# EAGLE design RelayDriverShield8 (EAGLE 9.4.2)
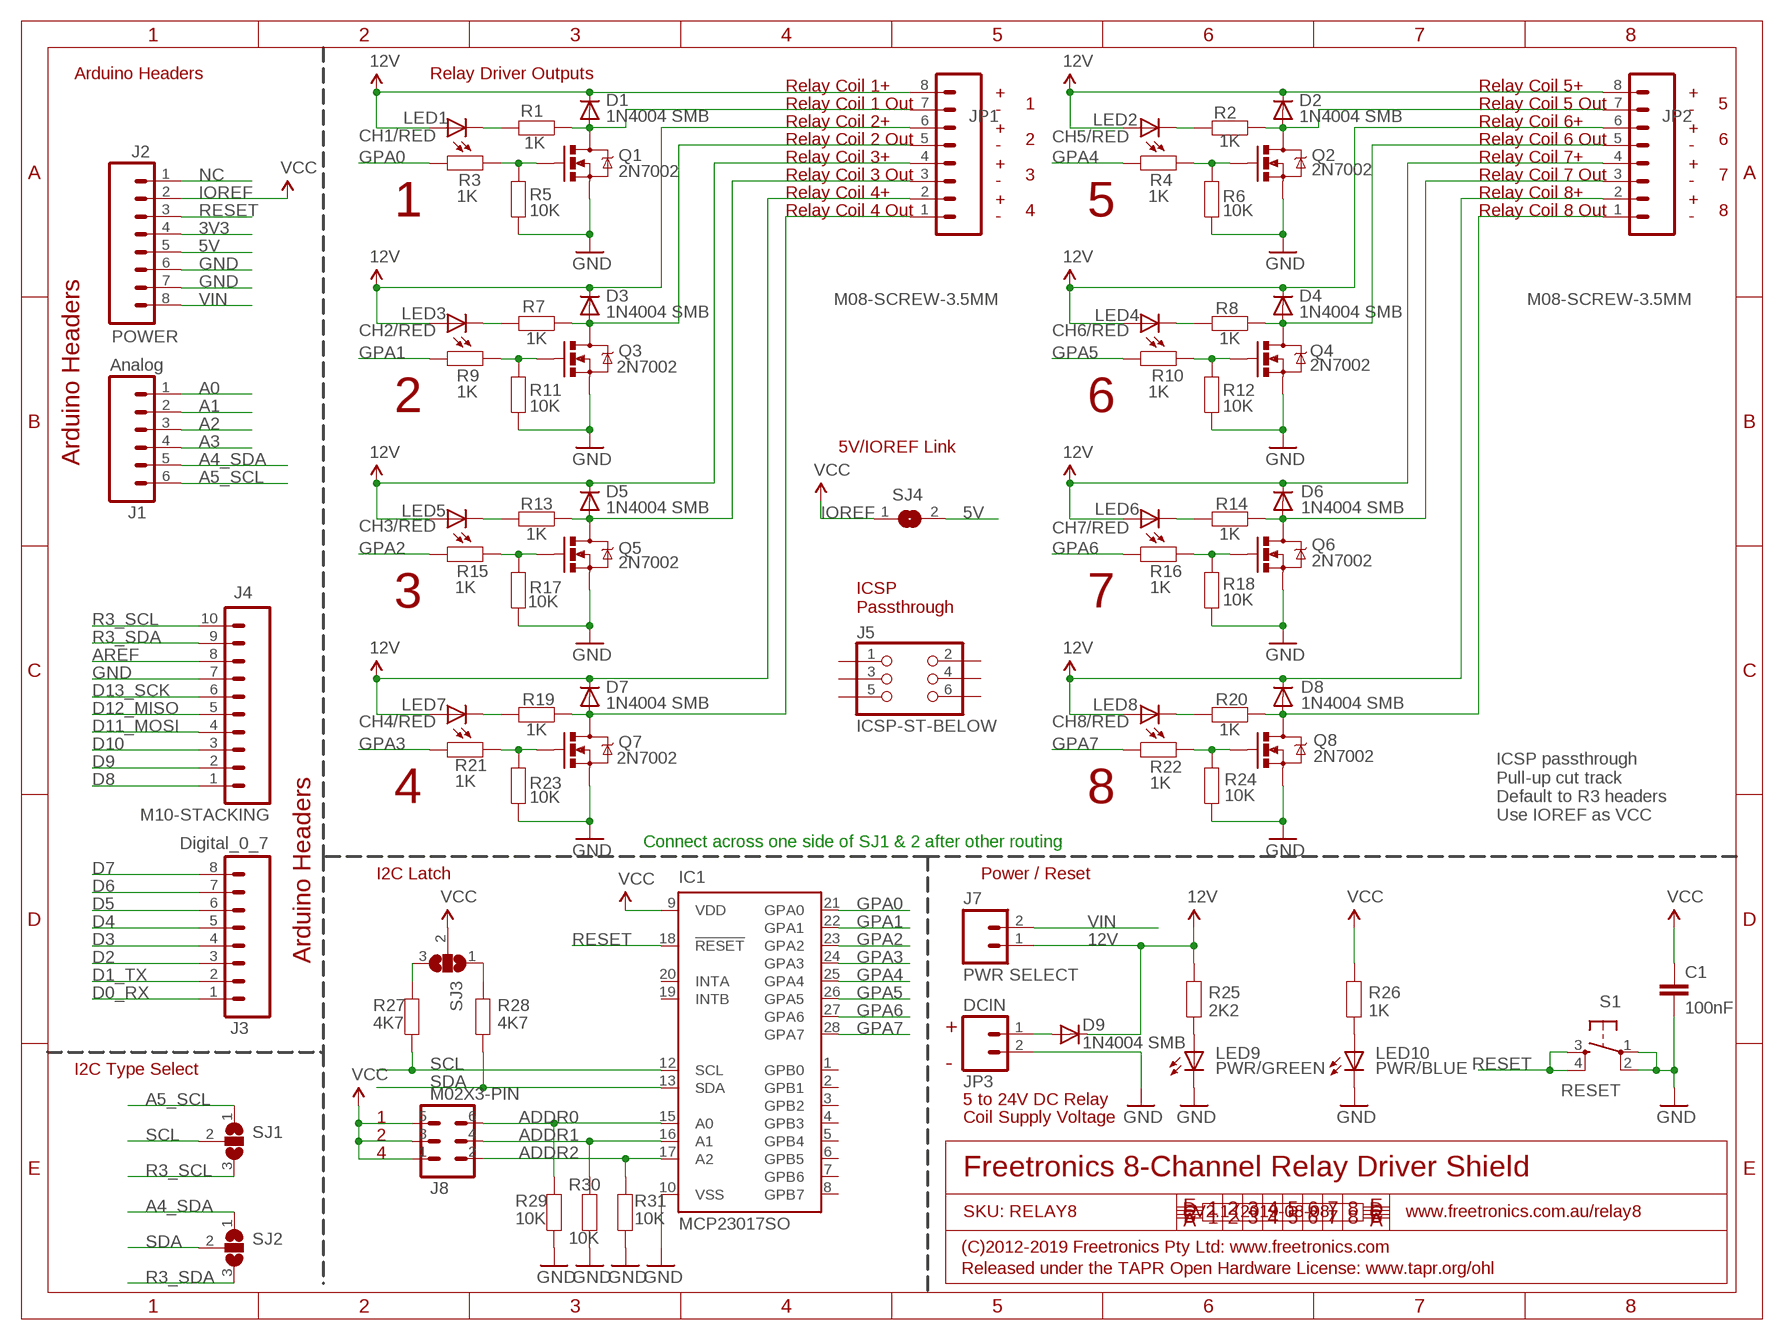
[diagram p0: schematic, sheet 1]

## Parts
C1  100nF  CAP0603  [C0603]
D1  1N4004 SMB  DIODESMA  [SMA-DIODE]
D2  1N4004 SMB  DIODESMA  [SMA-DIODE]
D3  1N4004 SMB  DIODESMA  [SMA-DIODE]
D4  1N4004 SMB  DIODESMA  [SMA-DIODE]
D5  1N4004 SMB  DIODESMA  [SMA-DIODE]
D6  1N4004 SMB  DIODESMA  [SMA-DIODE]
D7  1N4004 SMB  DIODESMA  [SMA-DIODE]
D8  1N4004 SMB  DIODESMA  [SMA-DIODE]
D9  1N4004 SMB  DIODESMA  [SMA-DIODE]
IC1  MCP23017SO  [SO28W]
J1  Analog  M06-STACKING  [1X06-ST]
J2  POWER  M08-STACKING  [1X08-ST]
J3  Digital_0_7  M08-STACKING  [1X08-ST]
J4  M10-STACKING  [1X10-ST]
J5  ICSP-ST-BELOW  [2X03-ICSP-ST-BELOW]
J7  PWR SELECT  M02-PIN  [1X02-P]
J8  M02X3-PIN  [2X03-P]
JP1  M08-SCREW-3.5MM  [SCREWTERMINAL_3.5MM_8]
JP2  M08-SCREW-3.5MM  [SCREWTERMINAL_3.5MM_8]
JP3  DCIN  M02-SCREW-3.5MM  [SCREWTERMINAL-3.5MM-2]
LED1  CH1/RED  LED0603  [LED-0603]
LED2  CH5/RED  LED0603  [LED-0603]
LED3  CH2/RED  LED0603  [LED-0603]
LED4  CH6/RED  LED0603  [LED-0603]
LED5  CH3/RED  LED0603  [LED-0603]
LED6  CH7/RED  LED0603  [LED-0603]
LED7  CH4/RED  LED0603  [LED-0603]
LED8  CH8/RED  LED0603  [LED-0603]
LED9  PWR/GREEN  LED0603  [LED-0603]
LED10  PWR/BLUE  LED0603  [LED-0603]
Q1  2N7002  MOSFET-NCHANNEL-233  [SOT23-3]
Q2  2N7002  MOSFET-NCHANNEL-233  [SOT23-3]
Q3  2N7002  MOSFET-NCHANNEL-233  [SOT23-3]
Q4  2N7002  MOSFET-NCHANNEL-233  [SOT23-3]
Q5  2N7002  MOSFET-NCHANNEL-233  [SOT23-3]
Q6  2N7002  MOSFET-NCHANNEL-233  [SOT23-3]
Q7  2N7002  MOSFET-NCHANNEL-233  [SOT23-3]
Q8  2N7002  MOSFET-NCHANNEL-233  [SOT23-3]
R1  1K  RESISTOR0603  [R0603]
R2  1K  RESISTOR0603  [R0603]
R3  1K  RESISTOR0603  [R0603]
R4  1K  RESISTOR0603  [R0603]
R5  10K  RESISTOR0603  [R0603]
R6  10K  RESISTOR0603  [R0603]
R7  1K  RESISTOR0603  [R0603]
R8  1K  RESISTOR0603  [R0603]
R9  1K  RESISTOR0603  [R0603]
R10  1K  RESISTOR0603  [R0603]
R11  10K  RESISTOR0603  [R0603]
R12  10K  RESISTOR0603  [R0603]
R13  1K  RESISTOR0603  [R0603]
R14  1K  RESISTOR0603  [R0603]
R15  1K  RESISTOR0603  [R0603]
R16  1K  RESISTOR0603  [R0603]
R17  10K  RESISTOR0603  [R0603]
R18  10K  RESISTOR0603  [R0603]
R19  1K  RESISTOR0603  [R0603]
R20  1K  RESISTOR0603  [R0603]
R21  1K  RESISTOR0603  [R0603]
R22  1K  RESISTOR0603  [R0603]
R23  10K  RESISTOR0603  [R0603]
R24  10K  RESISTOR0603  [R0603]
R25  2K2  RESISTOR0603  [R0603]
R26  1K  RESISTOR0603  [R0603]
R27  4K7  RESISTOR0603  [R0603]
R28  4K7  RESISTOR0603  [R0603]
R29  10K  RESISTOR0603  [R0603]
R30  10K  RESISTOR0603  [R0603]
R31  10K  RESISTOR0603  [R0603]
S1  RESET  TAC_SWITCH-SMT-6  [TACTILE_SMT-6MM]
SJ1  SJ2W  [SJ_2]
SJ2  SJ2W  [SJ_2]
SJ3  SJ2W  [SJ_2]
SJ4  SJN  [SJ]

## Nets
3V3: J2.4
5V: J2.5 SJ4.2
12V: D1.C D2.C D3.C D4.C D5.C D6.C D7.C D8.C D9.C J7.1 JP1.2 JP1.4 JP1.6 JP1.8 JP2.2 JP2.4 JP2.6 JP2.8 LED1.A LED2.A LED3.A LED4.A LED5.A LED6.A LED7.A LED8.A R25.2
A0: J1.1
A1: J1.2
A2: J1.3
A3: J1.4
A4_SDA: J1.5 SJ2.1
A5_SCL: J1.6 SJ1.1
ADDR0: IC1.15(A0) J8.6 R29.2
ADDR1: IC1.16(A1) J8.4 R30.2
ADDR2: IC1.17(A2) J8.2 R31.2
AREF: J4.8
D0_RX: J3.1
D1_TX: J3.2
D2: J3.3
D3: J3.4
D4: J3.5
D5: J3.6
D6: J3.7
D7: J3.8
D8: J4.1
D9: J4.2
D10: J4.3
D11_MOSI: J4.4
D12_MISO: J4.5
D13_SCK: J4.6
GND: C1.2 IC1.10(VSS) J2.6 J2.7 J4.7 JP3.2 LED9.C LED10.C Q1.2(S) Q2.2(S) Q3.2(S) Q4.2(S) Q5.2(S) Q6.2(S) Q7.2(S) Q8.2(S) R5.1 R6.1 R11.1 R12.1 R17.1 R18.1 R23.1 R24.1 R29.1 R30.1 R31.1 S1.1 S1.2
GPA0: IC1.21(GPA0) R3.2
GPA1: IC1.22(GPA1) R9.2
GPA2: IC1.23(GPA2) R15.2
GPA3: IC1.24(GPA3) R21.2
GPA4: IC1.25(GPA4) R4.2
GPA5: IC1.26(GPA5) R10.2
GPA6: IC1.27(GPA6) R16.2
GPA7: IC1.28(GPA7) R22.2
IOREF: C1.1 IC1.9(VDD) J2.2 J8.1 J8.3 J8.5 R26.2 SJ3.2 SJ4.1 ; supply symbol labelled VCC
N$1: Q1.1(G) R3.1 R5.2
N$3: D3.A JP1.5 Q3.3(D) R7.2
N$4: LED9.A R25.1
N$5: D1.A JP1.7 Q1.3(D) R1.2
N$8: Q3.1(G) R9.1 R11.2
N$9: D5.A JP1.3 Q5.3(D) R13.2
N$10: Q5.1(G) R15.1 R17.2
N$11: D7.A JP1.1 Q7.3(D) R19.2
N$12: Q7.1(G) R21.1 R23.2
N$13: D2.A JP2.7 Q2.3(D) R2.2
N$14: Q2.1(G) R4.1 R6.2
N$15: D4.A JP2.5 Q4.3(D) R8.2
N$16: Q4.1(G) R10.1 R12.2
N$17: D6.A JP2.3 Q6.3(D) R14.2
N$18: Q6.1(G) R16.1 R18.2
N$19: D8.A JP2.1 Q8.3(D) R20.2
N$20: Q8.1(G) R22.1 R24.2
N$21: LED3.C R7.1
N$22: LED7.C R19.1
N$23: LED5.C R13.1
N$24: LED1.C R1.1
N$25: LED2.C R2.1
N$26: LED4.C R8.1
N$27: LED6.C R14.1
N$28: LED8.C R20.1
N$41: D9.A JP3.1
N$42: R27.2 SJ3.3
N$43: R28.2 SJ3.1
N$52: LED10.A R26.1
NC: J2.1
R3_SCL: J4.10 SJ1.3
R3_SDA: J4.9 SJ2.3
RESET: IC1.18(!RESET) J2.3 S1.3 S1.4
SCL: IC1.12(SCL) R27.1 SJ1.2
SDA: IC1.13(SDA) R28.1 SJ2.2
VIN: J2.8 J7.2
Unconnected: IC1.1(GPB0) IC1.2(GPB1) IC1.3(GPB2) IC1.4(GPB3) IC1.5(GPB4) IC1.6(GPB5) IC1.7(GPB6) IC1.8(GPB7) IC1.19(INTB) IC1.20(INTA) J5.1 J5.2 J5.3 J5.4 J5.5 J5.6

## Notes on the sheet
- Arduino Headers | Relay Driver Outputs
- Relay Coil 1+ | Relay Coil 5+
- + | +
- Relay Coil 1 Out | 1 | Relay Coil 5 Out | 5
- - | -
- Relay Coil 2+ | Relay Coil 6+
- + | +
- Relay Coil 2 Out | 2 | Relay Coil 6 Out | 6
- - | -
- Relay Coil 3+ | Relay Coil 7+
- + | +
- Relay Coil 3 Out | 3 | Relay Coil 7 Out | 7
- - | -
- Relay Coil 4+ | Relay Coil 8+
- + | +
- 1 | Relay Coil 4 Out | 4 | 5 | Relay Coil 8 Out | 8
- - | -
- 2 | 6
- 5V/IOREF Link
- Arduino Headers
- 3 | 7
- ICSP
  Passthrough
- 4 | 8
- ICSP passthrough
  Pull-up cut track
  Default to R3 headers
  Use IOREF as VCC
- Connect across one side of SJ1 & 2 after other routing
- I2C Latch | Power / Reset
- Arduino Headers
- +
- -
- I2C Type Select
- 5 to 24V DC Relay
- 1 | Coil Supply Voltage
- 2
- 4
- Freetronics 8-Channel Relay Driver Shield
- SKU: RELAY8 | V2.1 (2019-08-08) | www.freetronics.com.au/relay8
- (C)2012-2019 Freetronics Pty Ltd: www.freetronics.com
- Released under the TAPR Open Hardware License: www.tapr.org/ohl

## Library data of the parts
C1 = SuperHouse-DiscreteSemi:CAP: Capacitor Standard ceramic capacitor
D1-D9 = SuperHouse-DiscreteSemi:DIODE: Diode Standard reverse protection diodes and small signal diodes. SMA package can handle up to about 1A. SOD-323 can handle about 200mA.
IC1 = SuperHouse-ICs:MCP23017: http://ww1.microchip.com/downloads/en/DeviceDoc/21952a.pdf Source: http://ww1.microchip.com/downloads/en/DeviceDoc/21952a.pdf
J1 = SuperHouse-Connectors:M06: 6-way header Standard 1x6 header, and screw terminal variations
J2 J3 JP1 JP2 = SuperHouse-Connectors:M08: 8-way header Standard 1x8 header, and screw terminal variations
J4 = SuperHouse-Connectors:M10: 10-way header Standard 1x10 header, and screw terminal variations
J5 = SuperHouse-Connectors:ICSP
J7 JP3 = SuperHouse-Connectors:M02: 2-way header Standard 1x2 header, and screw terminal variations
J8 = SuperHouse-Connectors:M02X3
LED1-LED10 = SuperHouse-LEDs:LED: LEDs Standard schematic elements and footprints for 5mm, 3mm, 1206, and 0603 sized LEDs. 5mm - Spark Fun Electronics SKU : COM-00529 (and others)
Q1-Q8 = SuperHouse-DiscreteSemi:MOSFET-NCHANNEL: N-channel MOSFET
R1-R31 = SuperHouse-DiscreteSemi:RESISTOR: Resistor Standard resistors.
S1 = SuperHouse-Switches:TAC_SWITCH: Momentary Switch Tactile switch, normally-open.
SJ1-SJ3 = freetronics-master-v1.1:SJ2W: SMD solder JUMPER
SJ4 = freetronics-jon:SJ: SMD solder JUMPER

## Board
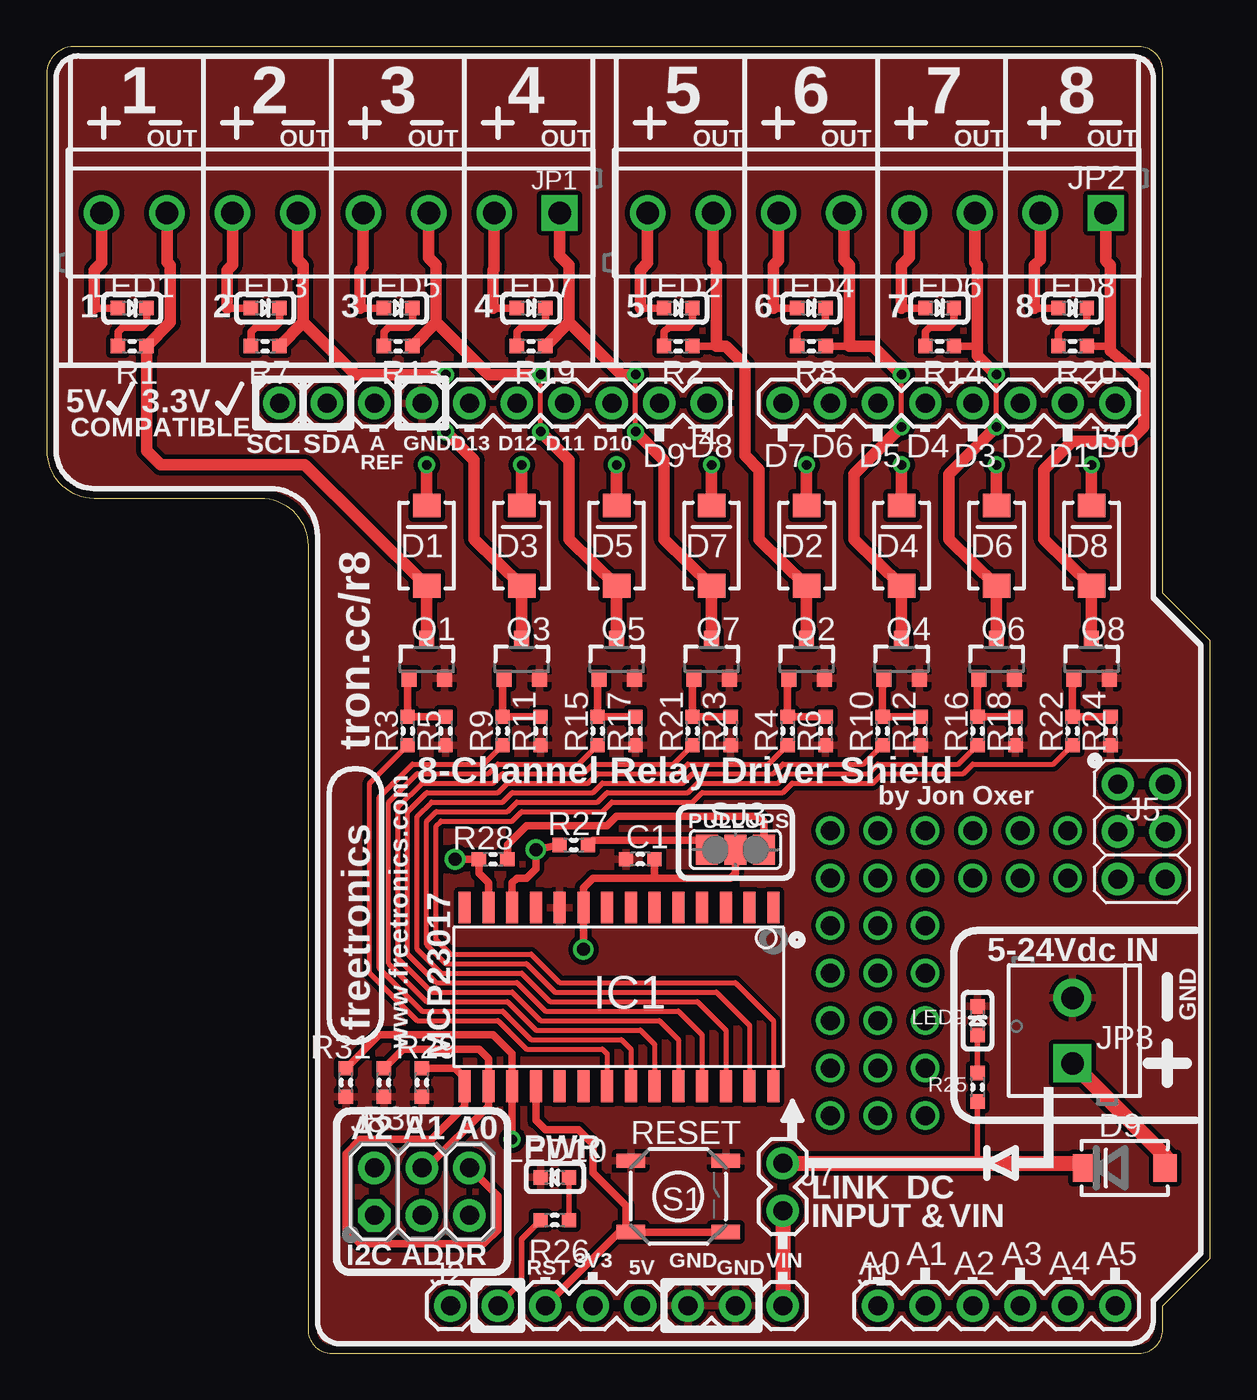
[diagram p1: board, top side]
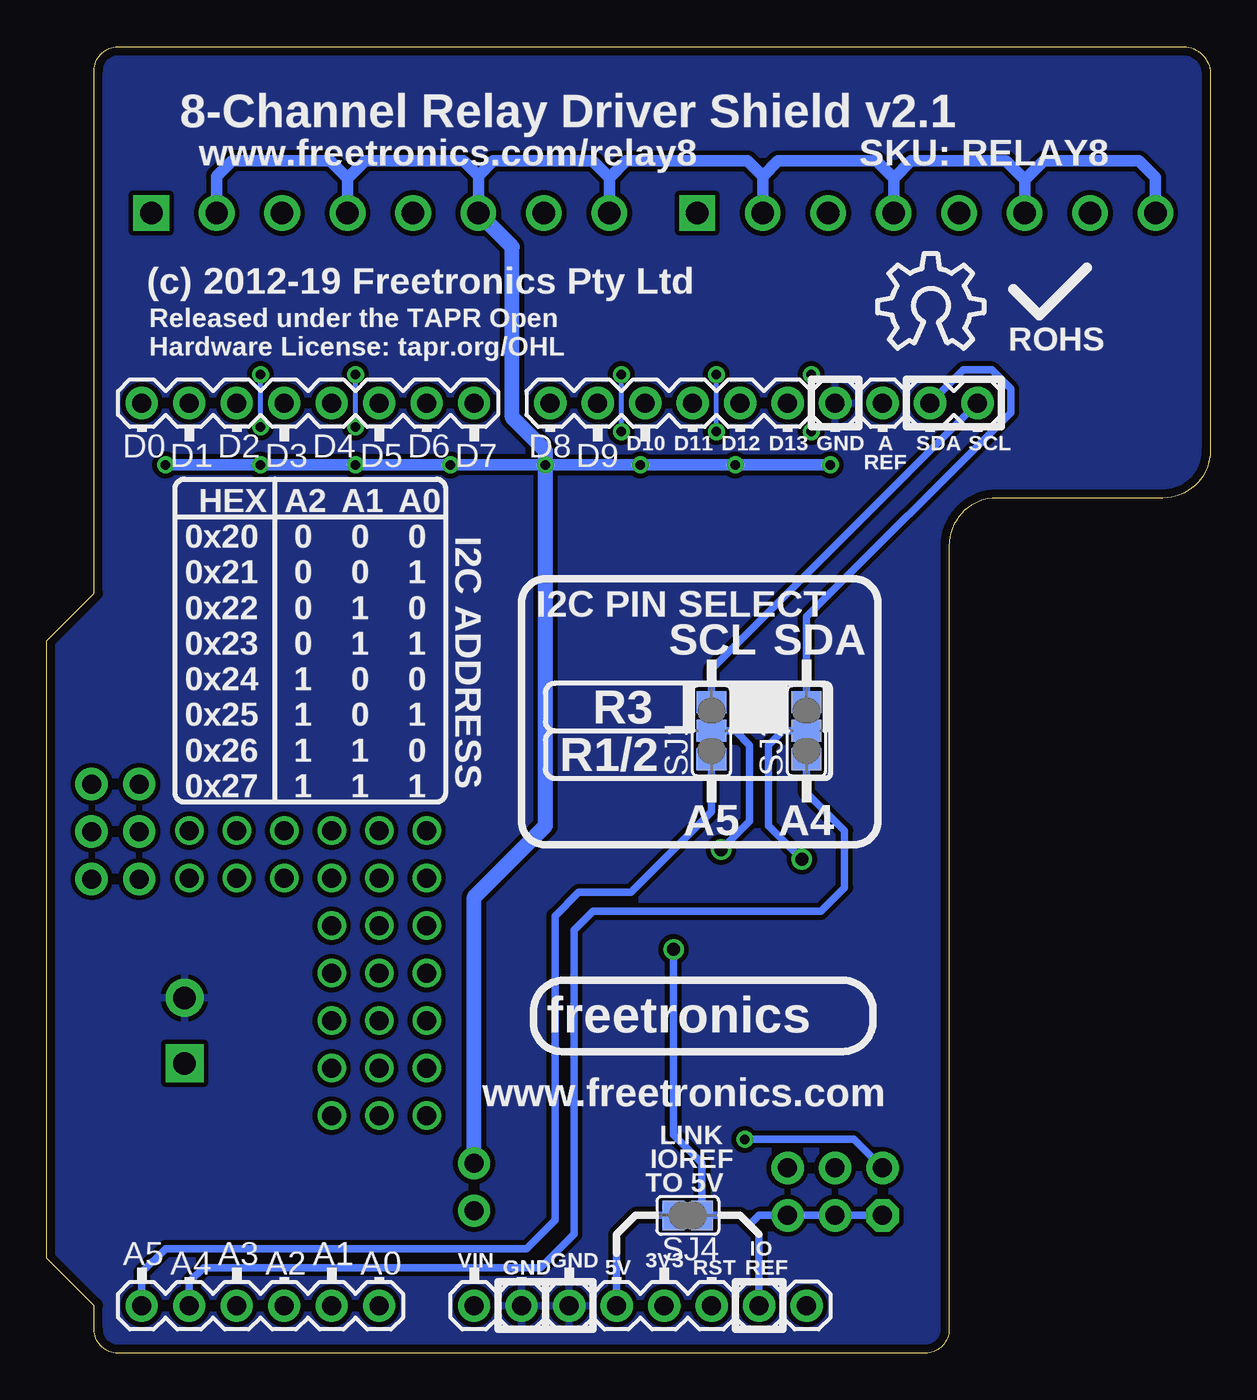
[diagram p2: board, bottom side, seen from below]

Size 62.23 x 69.85 mm. Coordinates in mm from the lower left corner, seen from the top.
Outline: 13.97,1.27 arc90 15.24,0 58.42,0 arc90 59.69,1.27 59.69,2.54 62.23,5.08 62.23,38.1 59.69,40.64 59.69,68.58 arc90 58.42,69.85 1.27,69.85 arc74 0,68.58 0,48.26 arc90 2.54,45.72 11.43,45.72 arc-90 13.97,43.18 13.97,1.27
Copper layers (1*16): Top 0.035mm / dielectric 1.5mm / Bottom 0.035mm
Design rules "default *": minimum track width 10mil, minimum drill 19mil, track to track 10mil, track to pad 12mil, pad to pad 12mil, via to via 12mil, smd to smd 8mil, copper to edge 18mil, drill to drill 8mil, minimum pad ring 14mil, minimum via ring 8mil, stop-mask expansion 4mil, vias tented up to drill 0mil, thermal gap 10mil

### Footprints (pad centres in the part's own frame; a part is rotated, then mirrored left to right if it is on the bottom)
C0603 = smd 0.762 x 0.762: 1 -0.762,0; 2 0.762,0
SMA-DIODE = smd 1.27 x 1.47: A -2.15,0; C 2.15,0
SO28W = smd 0.65 x 1.7: 1 -7.62,-4.78; 2 -6.35,-4.78; 3 -5.08,-4.78; 4 -3.81,-4.78; 5 -2.54,-4.78; 6 -1.27,-4.78; 7 0,-4.78; 8 1.27,-4.78; 9 2.54,-4.78; 10 3.81,-4.78; 11 5.08,-4.78; 12 6.35,-4.78; 13 7.62,-4.78; 14 8.89,-4.78; 15 8.89,4.78; 16 7.62,4.78; 17 6.35,4.78; 18 5.08,4.78; 19 3.81,4.78; 20 2.54,4.78; 21 1.27,4.78; 22 0,4.78; 23 -1.27,4.78; 24 -2.54,4.78; 25 -3.81,4.78; 26 -5.08,4.78; 27 -6.35,4.78; 28 -7.62,4.78
1X06-ST = drill 1.016: 1 0,0; 2 2.54,0; 3 5.08,0; 4 7.62,0; 5 10.16,0; 6 12.7,0
1X08-ST = drill 1.016: 1 0,0; 2 2.54,0; 3 5.08,0; 4 7.62,0; 5 10.16,0; 6 12.7,0; 7 15.24,0; 8 17.78,0
1X10-ST = drill 1.016: 1 0,0; 2 2.54,0; 3 5.08,0; 4 7.62,0; 5 10.16,0; 6 12.7,0; 7 15.24,0; 8 17.78,0; 9 20.32,0; 10 22.86,0
2X03-ICSP-ST-BELOW = drill 1.016: 1 -2.54,-1.27; 2 -2.54,1.27; 3 0,-1.27; 4 0,1.27; 5 2.54,-1.27; 6 2.54,1.27
1X02-P = drill 1.016: 1 0,0; 2 2.54,0
2X03-P = drill 1.016 octagon: 1 0,0 | drill 1.016: 2 0,2.54; 3 2.54,0; 4 2.54,2.54; 5 5.08,0; 6 5.08,2.54
SCREWTERMINAL_3.5MM_8 = drill 1.2 square: 1 0,0 | drill 1.2: 2 3.5,0; 3 7,0; 4 10.5,0; 5 14,0; 6 17.5,0; 7 21,0; 8 24.5,0
SCREWTERMINAL-3.5MM-2 = drill 1.2 pad 2.032 square: 1 0,0 | drill 1.2 pad 2.032: 2 3.5,0
LED-0603 = smd 0.762 x 0.762: A -0.762,0; C 0.762,0
SOT23-3 = smd 0.8 x 0.9: 1 -0.95,-1; 2 0.95,-1; 3 0,1.1
R0603 = smd 0.762 x 0.762: 1 -0.762,0; 2 0.762,0
TACTILE_SMT-6MM = smd 1.524 x 0.762: 1 -2.54,1.905; 2 2.54,1.905; 3 -2.54,-1.905; 4 2.54,-1.905
SJ_2 = smd 1.168 x 1.6: 1 -1.524,0; 2 0,0; 3 1.524,0
SJ = smd 1.168 x 1.6: 1 -0.762,0; 2 0.762,0

### Placement (x,y rotation side)
C1  31.75,26.42 180 top
D1  20.32,43.18 90 top
D2  40.64,43.18 90 top
D3  25.4,43.18 90 top
D4  45.72,43.18 90 top
D5  30.48,43.18 90 top
D6  50.8,43.18 90 top
D7  35.56,43.18 90 top
D8  55.88,43.18 90 top
D9  57.66,9.91 180 top
IC1  31.24,19.05 180 top
J1  44.45,2.54 0 top
J2  21.59,2.54 0 top
J3  57.15,50.8 180 top
J4  35.31,50.8 180 top
J5  58.56,27.89 270 top
J7  39.37,10.16 270 top
J8  17.53,7.37 0 top
JP1  27.43,60.96 180 top
JP2  56.64,60.96 180 top
JP3  54.86,15.49 90 top
LED1  4.57,55.88 0 top
LED2  33.78,55.88 0 top
LED3  11.68,55.88 0 top
LED4  40.89,55.88 0 top
LED5  18.8,55.88 0 top
LED6  47.75,55.88 0 top
LED7  25.91,55.88 0 top
LED8  54.86,55.88 0 top
LED9  49.78,17.78 90 top
LED10  27.18,9.4 180 top
Q1  20.32,37.08 0 top
Q2  40.64,37.08 0 top
Q3  25.4,37.08 0 top
Q4  45.72,37.08 0 top
Q5  30.48,37.08 0 top
Q6  50.8,37.08 0 top
Q7  35.56,37.08 0 top
Q8  55.88,37.08 0 top
R1  4.57,53.85 0 top
R2  33.78,53.85 0 top
R3  19.3,33.27 270 top
R4  39.62,33.27 270 top
R5  21.34,33.27 90 top
R6  41.66,33.27 90 top
R7  11.68,53.85 0 top
R8  40.89,53.85 0 top
R9  24.38,33.27 270 top
R10  44.7,33.27 270 top
R11  26.42,33.27 90 top
R12  46.74,33.27 90 top
R13  18.8,53.85 0 top
R14  47.75,53.85 0 top
R15  29.46,33.27 270 top
R16  49.78,33.27 270 top
R17  31.5,33.27 90 top
R18  51.82,33.27 90 top
R19  25.91,53.85 0 top
R20  54.86,53.85 0 top
R21  34.54,33.27 270 top
R22  54.86,33.27 270 top
R23  36.58,33.27 90 top
R24  56.9,33.27 90 top
R25  49.78,14.22 270 top
R26  27.18,7.11 180 top
R27  28.19,27.18 0 top
R28  23.88,26.42 0 top
R29  20.07,14.48 90 top
R30  18.03,14.48 90 top
R31  16,14.48 90 top
S1  33.78,8.38 0 top
SJ1  26.67,33.27 90 bottom
SJ2  21.59,33.27 90 bottom
SJ3  36.83,26.92 180 top
SJ4  27.94,7.37 180 bottom
U$6  [OSHW_10X200_NOTEXT]  17.78,53.72 0 bottom

### Tracks (layer width: path | path; a pad name or v marks a point on that pad's centre or on a via)
5V
  Bottom 0.406: SJ4.2 30.73,7.37 31.75,6.35 J2.5
12V  (via drill 0.5)
  Top 0.305: R25.2 49.78,10.16
  Top 0.406: 2.54,55.88 LED1.A | 9.65,55.88 LED3.A | 16.76,55.88 LED5.A | 23.88,55.88 LED7.A | 31.75,55.88 LED2.A | 38.86,55.88 LED4.A | 52.83,55.88 LED8.A | 45.72,55.88 LED6.A
  Top 0.61: 2.54,55.88 2.54,57.91 2.93,58.3 JP1.8 | 9.65,55.88 9.65,57.91 9.93,58.19 JP1.6 | 16.76,55.88 16.76,57.91 16.93,58.08 JP1.4 | 23.88,55.88 23.88,57.91 23.93,57.97 JP1.2 | 31.75,55.88 31.75,57.91 32.14,58.3 JP2.8 | 52.83,55.88 52.83,58.17 53.14,58.48 JP2.2 | 45.72,55.88 45.72,58.17 46.14,58.59 JP2.4 | 38.86,55.88 38.86,58.17 39.14,58.45 JP2.6 | v20.32,47.5 D1.C | v25.4,47.5 D3.C | v30.48,47.5 D5.C | v35.56,47.5 D7.C | v40.64,47.5 D2.C | v45.72,47.5 D4.C | v50.8,47.5 D6.C | v55.88,47.5 D8.C
  Top 0.813: D9.C 55.2,10.16 49.78,10.16 J7.1
  Bottom 0.61: JP1.8 2.93,62.88 3.81,63.75 8.89,63.75 9.91,62.74 | 9.91,62.74 9.91,60.99 JP1.6 | 16.93,62.82 JP1.4 | 16.93,62.82 16,63.75 10.92,63.75 9.91,62.74 | 23.93,62.94 JP1.2 | 23.93,62.94 23.11,63.75 17.86,63.75 16.93,62.82 | 32.14,62.85 JP2.8 | 32.14,62.85 31.24,63.75 24.75,63.75 23.93,62.94 | JP2.6 39.14,62.97 | 39.14,62.97 38.35,63.75 33.04,63.75 32.14,62.85 | 46.14,62.82 JP2.4 | 46.14,62.82 45.21,63.75 39.93,63.75 39.14,62.97 | JP2.2 53.14,62.94 52.32,63.75 47.07,63.75 46.14,62.82 | v20.32,47.5 v25.4,47.5 v30.48,47.5 v35.56,47.5 v40.64,47.5 v45.72,47.5 v50.8,47.5 v55.88,47.5
  Bottom 0.813: J7.1 39.37,24.38 35.56,28.19 v35.56,47.5 35.56,48.26 37.34,50.04 37.34,59.16 JP2.6
A4_SDA
  Bottom 0.406: J1.5 54.61,3.81 53.85,4.57 35.81,4.57 34.04,6.35 34.04,22.61 33.02,23.62 20.83,23.62 19.56,24.89 19.56,27.94 21.59,29.97 SJ2.1
A5_SCL
  Bottom 0.406: J1.6 57.15,4.32 55.88,5.59 36.58,5.59 35.05,7.11 35.05,23.37 33.78,24.64 30.99,24.64 26.67,28.96 SJ1.1
ADDR0
  Top 0.406: R29.2 21.84,15.24 22.35,14.73 IC1.15 22.35,13.21 20.57,11.43 20.32,11.43 16.76,11.43 16,10.67 16,6.6 16.76,5.84 23.37,5.84 24.13,6.6 24.13,8.38 J8.6
ADDR1
  Top 0.406: R30.2 19.05,16.26 23.11,16.26 23.62,15.75 IC1.16 23.62,13.21 20.32,9.91 J8.4
ADDR2  (via drill 0.5)
  Top 0.406: v24.89,11.43 IC1.17 24.89,16 23.88,17.02 17.78,17.02 R31.2
  Bottom 0.406: J8.2 19.05,11.43 v24.89,11.43
GND
  pour Bottom: 0,68.58 arc-74 1.27,69.85 58.42,69.85 arc-74 59.69,68.58 59.69,40.64 62.23,38.1 62.23,5.08 59.69,2.54 59.69,1.27 arc-74 58.42,0 15.24,0 arc-90 13.97,1.27 13.97,43.18 arc90 11.43,45.72 2.54,45.72 arc-90 0,48.26
  pour Top: 0,68.58 arc-74 1.27,69.85 58.42,69.85 arc-74 59.69,68.58 59.69,40.64 62.23,38.1 62.23,5.08 59.69,2.54 59.69,1.27 arc-74 58.42,0 15.24,0 arc-90 13.97,1.27 13.97,43.18 arc90 11.43,45.72 2.54,45.72 arc-90 0,48.26
GPA0
  Top 0.254: IC1.21 29.97,16 29.72,16.26 25.65,16.26 24.13,17.78 19.81,17.78 17.27,20.32 17.27,30.48 R3.2
GPA1
  Top 0.254: IC1.22 31.24,16.26 30.73,16.76 25.91,16.76 24.38,18.29 20.07,18.29 17.78,20.57 17.78,29.72 19.56,31.5 23.37,31.5 R9.2
GPA2
  Top 0.254: IC1.23 32.51,16.51 31.75,17.27 26.16,17.27 24.64,18.8 20.32,18.8 18.29,20.83 18.29,29.46 19.81,30.99 23.62,30.99 24.13,31.5 28.45,31.5 R15.2
GPA3
  Top 0.254: IC1.24 33.78,16.76 32.77,17.78 26.42,17.78 24.89,19.3 20.57,19.3 18.8,21.08 18.8,29.21 20.07,30.48 23.88,30.48 24.38,30.99 28.7,30.99 29.21,31.5 33.53,31.5 R21.2
GPA4
  Top 0.254: IC1.25 35.05,17.02 33.78,18.29 26.67,18.29 25.15,19.81 20.83,19.81 19.3,21.34 19.3,28.96 20.32,29.97 24.13,29.97 24.64,30.48 28.96,30.48 29.46,30.99 33.78,30.99 34.29,31.5 38.61,31.5 R4.2
GPA5
  Top 0.254: IC1.26 36.32,17.27 34.8,18.8 26.92,18.8 25.4,20.32 21.08,20.32 19.81,21.59 19.81,28.7 20.57,29.46 24.38,29.46 24.89,29.97 29.21,29.97 29.72,30.48 34.04,30.48 34.54,30.99 38.86,30.99 39.37,31.5 43.69,31.5 R10.2
GPA6
  Top 0.254: IC1.27 37.59,17.53 35.81,19.3 27.18,19.3 25.65,20.83 21.34,20.83 20.32,21.84 20.32,28.45 20.83,28.96 24.64,28.96 25.15,29.46 29.46,29.46 29.97,29.97 34.29,29.97 34.8,30.48 39.12,30.48 39.62,30.99 43.94,30.99 44.45,31.5 48.77,31.5 R16.2
GPA7
  Top 0.254: IC1.28 38.86,17.78 36.83,19.81 27.43,19.81 25.91,21.34 21.59,21.34 20.83,22.1 20.83,28.19 21.08,28.45 24.89,28.45 25.4,28.96 29.72,28.96 30.23,29.46 34.54,29.46 35.05,29.97 39.37,29.97 39.88,30.48 44.2,30.48 44.7,30.99 49.02,30.99 49.53,31.5 53.85,31.5 R22.2
IOREF  (via drill 0.7)
  Top 0.305: R26.2 25.4,6.1 25.4,3.81 J2.2
  Top 0.406: v28.7,21.59 IC1.9 28.7,24.89 29.21,25.4 32.51,25.4 | 32.51,25.4 C1.1 | SJ3.2 36.83,25.65 36.58,25.4 32.51,25.4
  Bottom 0.406: v28.7,21.59 28.7,11.68 27.18,10.16 SJ4.1 25.15,7.37 24.64,6.86 | 24.64,6.86 24.13,6.35 J2.2 | 24.64,6.86 24.13,7.37 J8.5 J8.3 J8.1
N$1
  Top 0.406: R5.2 R3.1 19.3,36.02 Q1.1
N$2  (via drill 1.02)
  other vias: 46.99,27.94
N$3  (via drill 0.5)
  Top 0.254: v21.34,49.28 v21.34,52.32
  Top 0.61: Q3.3 D3.A | D3.A 25.4,41.15 | 13.72,55.12 13.72,58.17 13.43,58.45 JP1.5 | 13.72,55.12 R7.2 | 13.72,55.12 16.51,52.32 v21.34,52.32 | D3.A 22.86,43.52 22.86,47.75 v21.34,49.28
  Bottom 0.254: v21.34,49.28 v21.34,52.32
N$4
  Top 0.305: R25.1 LED9.A
N$5
  Top 0.61: D1.A Q1.3 | D1.A 20.66,40.98 | JP1.7 6.43,58.34 6.6,58.17 6.6,55.12 R1.2 5.33,48.26 6.1,47.5 13.8,47.5 D1.A
N$6  (via drill 1.02)
  other vias: 44.45,20.32
N$7  (via drill 1.02)
  other vias: 41.91,20.32
N$8
  Top 0.406: R11.2 R9.1 24.38,36.02 Q3.1
N$9  (via drill 0.5)
  Top 0.254: v26.42,49.28 v26.42,52.32
  Top 0.61: Q5.3 D5.A | 20.83,55.12 20.83,58.17 20.43,58.56 JP1.3 | 20.83,55.12 R13.2 | D5.A 30.48,41.15 | v26.42,49.28 27.94,47.75 27.94,43.52 D5.A | 20.83,55.12 23.62,52.32 v26.42,52.32
  Bottom 0.254: v26.42,49.28 v26.42,52.32
N$10
  Top 0.406: R17.2 R15.1 29.46,36.02 Q5.1
N$11  (via drill 0.5)
  Top 0.254: v31.5,49.28 v31.5,52.32
  Top 0.61: 27.94,55.12 27.94,58.17 27.43,58.67 JP1.1 | Q7.3 D7.A | D7.A 35.56,41.15 | v31.5,49.28 33.02,47.75 33.02,43.52 D7.A | 27.94,55.12 R19.2 | 27.94,55.12 30.73,52.32 v31.5,52.32
  Bottom 0.254: v31.5,49.28 v31.5,52.32
N$12
  Top 0.406: R23.2 R21.1 34.54,36.02 Q7.1
N$13
  Top 0.406: 35.81,53.85 R2.2
  Top 0.61: Q2.3 D2.A 38.1,43.52 38.1,47.24 37.34,48.01 37.34,52.83 36.32,53.85 35.81,53.85 35.81,58.17 35.64,58.34 JP2.7
N$14
  Top 0.406: R6.2 R4.1 39.62,35.64 39.88,35.9 Q2.1
N$15  (via drill 0.5)
  Top 0.254: v45.72,49.53 v45.72,52.32
  Top 0.406: 42.93,53.85 R8.2
  Top 0.61: Q4.3 D4.A 43.18,43.52 43.18,46.99 v45.72,49.53 | JP2.5 42.64,58.45 42.93,58.17 42.93,53.85 44.2,53.85 v45.72,52.32
  Bottom 0.254: v45.72,49.53 v45.72,52.32
N$16
  Top 0.406: R12.2 R10.1 44.7,35.64 44.96,35.9 Q4.1
N$17  (via drill 0.5)
  Top 0.254: v50.8,49.53 v50.8,52.32
  Top 0.406: 49.78,53.85 R14.2
  Top 0.61: Q6.3 D6.A | D6.A 50.89,40.98 | v50.8,49.53 48.26,46.99 48.26,43.52 D6.A | JP2.3 49.64,58.31 49.78,58.17 49.78,53.85 49.78,53.34 v50.8,52.32
  Bottom 0.254: v50.8,49.53 v50.8,52.32
N$18
  Top 0.406: R18.2 R16.1 49.78,35.64 50.04,35.9 Q6.1
N$19
  Top 0.406: 56.9,53.85 R20.2
  Top 0.61: Q8.3 D8.A | D8.A 55.97,40.98 | JP2.1 56.64,58.42 56.9,58.17 56.9,53.85 56.9,53.59 58.67,52.07 58.67,49.53 57.91,48.77 54.86,48.77 53.34,47.24 53.34,43.52 D8.A
N$20
  Top 0.406: R24.2 R22.1 54.86,35.64 55.12,35.9 Q8.1
N$21
  Top 0.406: R7.1 10.92,54.61 11.18,54.86 12.19,54.86 12.45,55.12 LED3.C
N$22
  Top 0.406: R19.1 25.15,54.61 25.4,54.86 26.42,54.86 26.67,55.12 LED7.C
N$23
  Top 0.406: R13.1 18.03,54.61 18.29,54.86 19.3,54.86 19.56,55.12 LED5.C
N$24
  Top 0.406: R1.1 3.81,54.61 4.06,54.86 5.08,54.86 5.33,55.12 LED1.C
N$25
  Top 0.406: R2.1 33.02,54.61 33.27,54.86 34.29,54.86 34.54,55.12 LED2.C
N$26
  Top 0.406: R8.1 40.13,54.61 40.39,54.86 41.4,54.86 41.66,55.12 LED4.C
N$27
  Top 0.406: R14.1 46.99,54.61 47.24,54.86 48.26,54.86 48.51,55.12 LED6.C
N$28
  Top 0.406: R20.1 54.1,54.61 54.36,54.86 55.37,54.86 55.63,55.12 LED8.C
N$29  (via drill 1.02)
  other vias: 44.45,27.94
N$30  (via drill 1.02)
  other vias: 44.45,17.78
N$31  (via drill 1.02)
  other vias: 41.91,17.78
N$32  (via drill 1.02)
  other vias: 54.61,27.94
N$33  (via drill 1.02)
  other vias: 52.07,27.94
N$34  (via drill 1.02)
  other vias: 49.53,27.94
N$35  (via drill 1.02)
  other vias: 44.45,15.24
N$36  (via drill 1.02)
  other vias: 41.91,15.24
N$37  (via drill 1.02)
  other vias: 46.99,22.86
N$38  (via drill 1.02)
  other vias: 46.99,20.32
N$39  (via drill 1.02)
  other vias: 44.45,12.7
N$40  (via drill 1.02)
  other vias: 41.91,12.7
N$41
  Top 0.813: 55.03,15.49 JP3.1 59.86,10.5 D9.A
N$42
  Top 0.406: R27.2 29.21,27.43 35.05,27.43 SJ3.3
N$43
  Top 0.406: R28.2 24.64,27.18 25.65,28.19 29.97,28.19 30.48,28.7 38.1,28.7 38.35,28.45 SJ3.1
N$44  (via drill 1.02)
  other vias: 46.99,17.78
N$45  (via drill 1.02)
  other vias: 46.99,15.24
N$46  (via drill 1.02)
  other vias: 46.99,12.7
N$47
  Top 0.254: 37.08,26.92 38.1,26.92
N$48
  Top 0.254: 36.58,26.92 35.56,26.92
N$49
  Bottom 0.254: 26.67,34.54 26.67,33.53
N$52
  Top 0.305: LED10.A R26.1
N$125  (via drill 1.02)
  other vias: 44.45,22.86
N$126  (via drill 1.02)
  other vias: 41.91,22.86
N$140  (via drill 1.02)
  other vias: 46.99,25.4
N$141  (via drill 1.02)
  other vias: 44.45,25.4
N$142  (via drill 1.02)
  other vias: 41.91,25.4
N$156  (via drill 1.02)
  other vias: 41.91,27.94
N$157  (via drill 1.02)
  other vias: 54.61,25.4
N$158  (via drill 1.02)
  other vias: 52.07,25.4
N$159  (via drill 1.02)
  other vias: 49.53,25.4
R3_SCL
  Bottom 0.406: SJ1.3 26.67,36.58 J4.10
R3_SDA
  Bottom 0.254: SJ2.3 21.59,33.53
  Bottom 0.406: SJ2.3 21.59,39.37 10.67,50.29 10.67,51.56 11.68,52.58 13.21,52.58 J4.9
RESET
  Top 0.406: S1.4 S1.3 30.99,6.6 | IC1.18 26.16,12.45 26.67,11.94 28.45,11.94 29.21,11.18 29.21,9.65 30.99,7.87 30.99,6.6 | 30.99,6.6 30.73,6.6 J2.3
SCL  (via drill 0.7)
  Top 0.406: R27.1 v26.16,26.92 26.16,25.91 25.65,25.4 25.15,25.4 24.89,25.15 IC1.12
  Bottom 0.406: SJ1.2 25.4,33.27 24.64,32.51 24.64,28.45 v26.16,26.92
SDA  (via drill 0.7)
  Top 0.406: v21.84,26.42 R28.1 23.11,25.65 23.62,25.15 IC1.13
  Bottom 0.406: SJ2.2 22.86,33.27 23.62,32.51 23.62,28.19 v21.84,26.42
VIN
  Top 0.813: J7.2 J2.8

### Text on the board
tPlace: 1 | 2 | 3 | 4 | 5 | 6 | 7 | 8 | OUT | OUT | OUT | OUT | OUT | OUT | OUT | OUT | 1 | 2 | 3 | 4 | 5 | 6 | 7 | 8 | 5V | 3.3V | COMPATIBLE | SCL | SDA | A | GND | D13 | D12 | D11 | D10 | D8 | D6 | D4 | D2 | D0 | REF | D9 | D7 | D5 | D3 | D1 | tron.cc/r8 | 8-Channel Relay Driver Shield | by Jon Oxer | PULLUPS | 5-24Vdc IN | GND | freetronics | www.freetronics.com | MCP23017 | A2 | A1 | A0 | RESET | PWR | LINK | DC | INPUT | & | VIN | I2C ADDR | 3V3 | GND | VIN | A1 | A3 | A5 | RST | 5V | GND | A0 | A2 | A4
bPlace: 8-Channel Relay Driver Shield v2.1 | SKU: RELAY8 | www.freetronics.com/relay8 | (c) 2012-19 Freetronics Pty Ltd | ROHS | Released under the TAPR Open / Hardware License: tapr.org/OHL | SCL | SDA | A | GND | D13 | D12 | D11 | D10 | D8 | D6 | D4 | D2 | D0 | REF | D9 | D7 | D5 | D3 | D1 | A0 | A1 | A2 | HEX | I2C ADDRESS | I2C PIN SELECT | SDA | SCL | R3 | R1/2 | 0 / 1 / 0 / 1 / 0 / 1 / 0 / 1 | 0 / 0 / 1 / 1 / 0 / 0 / 1 / 1 | 0 / 0 / 0 / 0 / 1 / 1 / 1 / 1 | 0x20 / 0x21 / 0x22 / 0x23 / 0x24 / 0x25 / 0x26 / 0x27 | A4 | A5 | freetronics | www.freetronics.com | LINK | IOREF | TO 5V | IO | 3V3 | GND | VIN | A1 | A3 | A5 | REF | RST | 5V | GND | A0 | A2 | A4
tDocu: A | K | A | K | A | K | A | K | A | K | A | K | A | K | A | K | K | A | K | A | K | A